# EAGLE design OpenScoreboard (EAGLE 6.5.0)
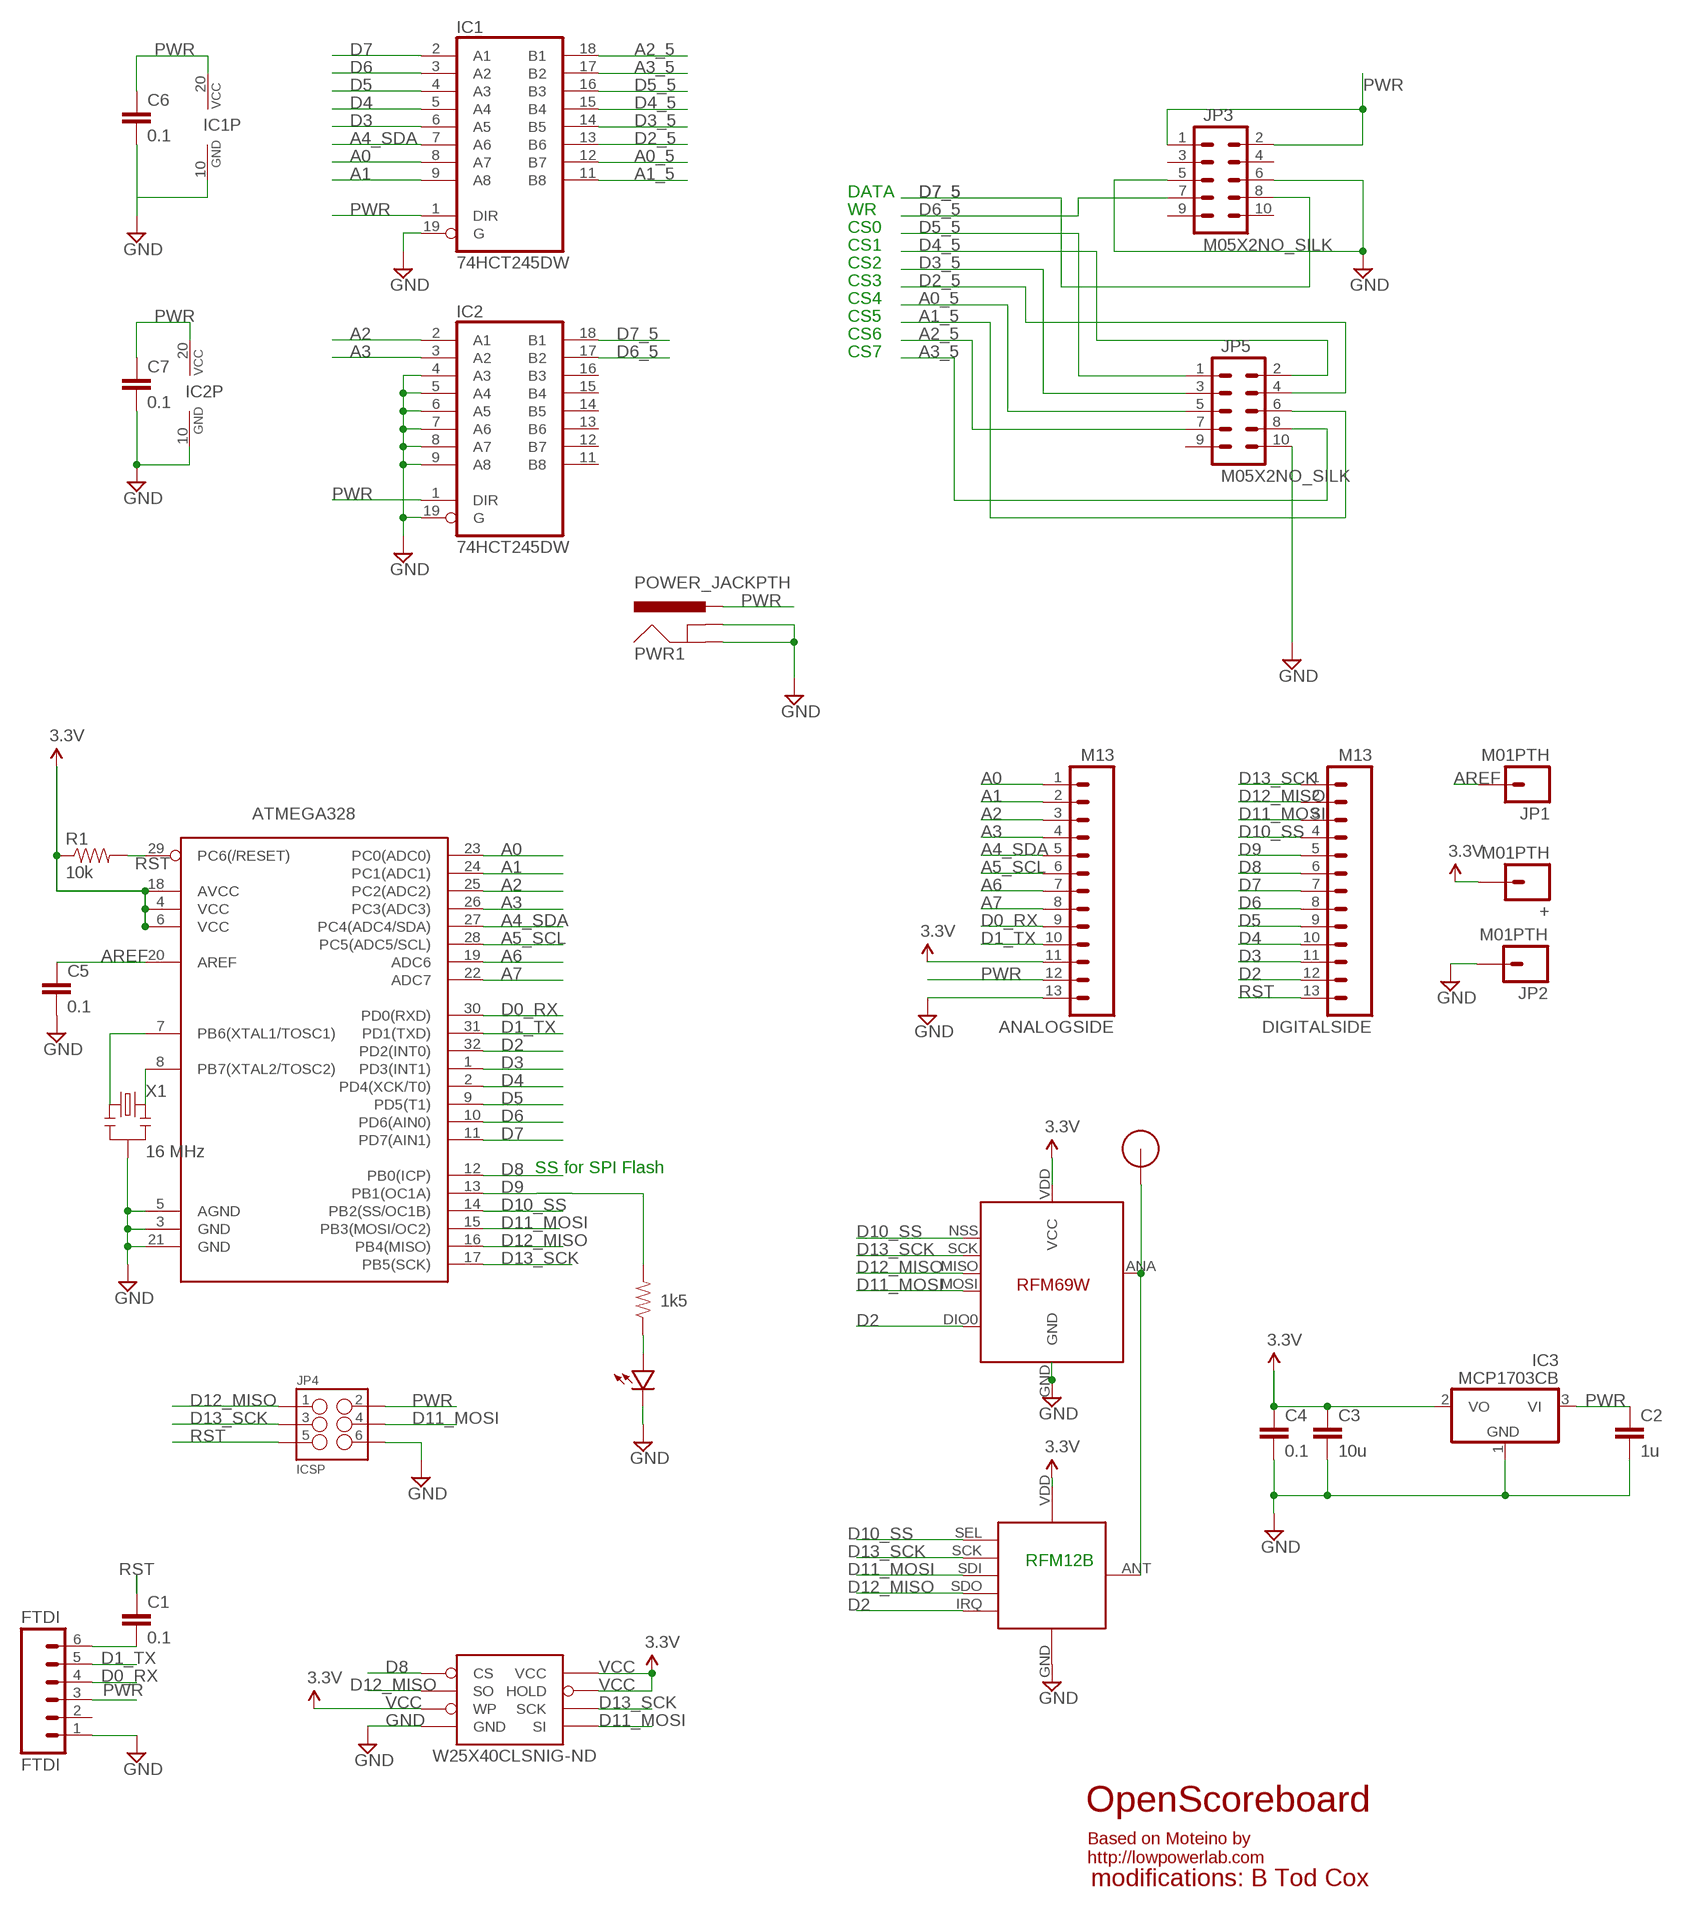
[diagram p0: schematic, sheet 1]

## Parts
+  M01PTH  [1X01]
ANALOGSIDE  M13  [1X13]
ATMEGA328  ATMega-328  ATMEGA168/328TQFP32  [TQFP32-08]
C1  0.1  CAP0603-CAP  [0603-CAP]
C2  1u  CAP0603-CAP  [0603-CAP]
C3  10u  CAP0805-CAP  [0805-CAP]
C4  0.1  CAP0603-CAP  [0603-CAP]
C5  0.1  CAP0603-CAP  [0603-CAP]
C6  0.1  CAP0603-CAP  [0603-CAP]
C7  0.1  CAP0603-CAP  [0603-CAP]
DIGITALSIDE  M13  [1X13]
FTDI  FTDI  M06SIP  [1X06]
IC1  74HCT245DW  [SO20W]
IC2  74HCT245DW  [SO20W]
IC3  MCP1703CB  [SOT23]
JP1  M01PTH  [1X01]
JP2  M01PTH  [1X01]
JP3  M05X2NO_SILK  [2X5_NOSILK]
JP4  ICSP  M03X2POGO_PINS  [2X3_POGO]
JP5  M05X2NO_SILK  [2X5_NOSILK]
PWR1  POWER_JACKPTH  [POWER_JACK_PTH]
R1  10k  RESISTOR0603-RES  [0603-RES]
R2  1k5  RESISTOR0603-RES  [0603-RES]
RFM12B  RFM12B_MINPADS  [RFM12B-MINPADS]
U$1  RFM12B_ANTENNA  [RFM12B-ANTENNA]
U$2  LED0603  [0603-LED]
U$5  RFM69  [RFM69W-MINPADS]
W25X40CLSNIG-ND  AT25F512BWIDE_5.3MM  [SO08WIDE]
X1  16 MHz  RESONATORSMD  [RESONATOR-SMD]

## Nets
A0: ANALOGSIDE.1 ATMEGA328.23(PC0(ADC0)) IC1.8(A7)
A0_5: IC1.12(B7) JP5.5
A1: ANALOGSIDE.2 ATMEGA328.24(PC1(ADC1)) IC1.9(A8)
A1_5: IC1.11(B8) JP5.6
A2: ANALOGSIDE.3 ATMEGA328.25(PC2(ADC2)) IC2.2(A1)
A2_5: IC1.18(B1) JP5.7
A3: ANALOGSIDE.4 ATMEGA328.26(PC3(ADC3)) IC2.3(A2)
A3_5: IC1.17(B2) JP5.8
A4_SDA: ANALOGSIDE.5 ATMEGA328.27(PC4(ADC4/SDA)) IC1.7(A6)
A5_SCL: ANALOGSIDE.6 ATMEGA328.28(PC5(ADC5/SCL))
A6: ANALOGSIDE.7 ATMEGA328.19(ADC6)
A7: ANALOGSIDE.8 ATMEGA328.22(ADC7)
AREF: ATMEGA328.20(AREF) C5.1 JP1.1
D0_RX: ANALOGSIDE.9 ATMEGA328.30(PD0(RXD)) FTDI.4
D1_TX: ANALOGSIDE.10 ATMEGA328.31(PD1(TXD)) FTDI.5
D2: ATMEGA328.32(PD2(INT0)) DIGITALSIDE.12 RFM12B.IRQ U$5.DIO0
D2_5: IC1.13(B6) JP5.4
D3: ATMEGA328.1(PD3(INT1)) DIGITALSIDE.11 IC1.6(A5)
D3_5: IC1.14(B5) JP5.3
D4: ATMEGA328.2(PD4(XCK/T0)) DIGITALSIDE.10 IC1.5(A4)
D4_5: IC1.15(B4) JP5.2
D5: ATMEGA328.9(PD5(T1)) DIGITALSIDE.9 IC1.4(A3)
D5_5: IC1.16(B3) JP5.1
D6: ATMEGA328.10(PD6(AIN0)) DIGITALSIDE.8 IC1.3(A2)
D6_5: IC2.17(B2) JP3.7
D7: ATMEGA328.11(PD7(AIN1)) DIGITALSIDE.7 IC1.2(A1)
D7_5: IC2.18(B1) JP3.8
D8: ATMEGA328.12(PB0(ICP)) DIGITALSIDE.6 W25X40CLSNIG-ND.1(CS)
D9: ATMEGA328.13(PB1(OC1A)) DIGITALSIDE.5 R2.2
D10_SS: ATMEGA328.14(PB2(SS/OC1B)) DIGITALSIDE.4 RFM12B.SEL U$5.NSS(SEL)
D11_MOSI: ATMEGA328.15(PB3(MOSI/OC2)) DIGITALSIDE.3 JP4.P$4 RFM12B.SDI(SDI/MOSI) U$5.MOSI W25X40CLSNIG-ND.5(SI)
D12_MISO: ATMEGA328.16(PB4(MISO)) DIGITALSIDE.2 JP4.P$1 RFM12B.SDO(SDO/MISO) U$5.MISO W25X40CLSNIG-ND.2(SO)
D13_SCK: ATMEGA328.17(PB5(SCK)) DIGITALSIDE.1 JP4.P$3 RFM12B.SCK U$5.SCK W25X40CLSNIG-ND.6(SCK)
GND [power]: ANALOGSIDE.13 ATMEGA328.3(GND) ATMEGA328.5(AGND) ATMEGA328.21(GND) C2.2 C3.2 C4.2 C5.2 C6.2 C7.2 FTDI.1 IC1.10(GND) IC1.19(G) IC2.4(A3) IC2.5(A4) IC2.6(A5) IC2.7(A6) IC2.8(A7) IC2.9(A8) IC2.10(GND) IC2.19(G) IC3.1(GND) JP2.1 JP3.5 JP3.6 JP4.P$6 JP5.10 PWR1.GND PWR1.GNDBREAK RFM12B.GND U$2.MINUS U$5.GND W25X40CLSNIG-ND.4(GND) X1.2
N$1: ATMEGA328.7(PB6(XTAL1/TOSC1)) X1.1
N$2: R2.1 U$2.PLUS
N$3: RFM12B.ANT U$1.P$1 U$5.ANA(ANT)
N$20: C1.2 FTDI.6
N$21: ATMEGA328.8(PB7(XTAL2/TOSC2)) X1.3
PWR [power]: ANALOGSIDE.12 C2.1 C6.1 C7.1 FTDI.3 IC1.1(DIR) IC1.20(VCC) IC2.1(DIR) IC2.20(VCC) IC3.3(VI) JP3.1 JP3.2 JP4.P$2 PWR1.PWR
RST: ATMEGA328.29(PC6(/RESET)) C1.1 DIGITALSIDE.13 JP4.P$5 R1.2
VCC: +.1 ANALOGSIDE.11 ATMEGA328.4(VCC) ATMEGA328.6(VCC) ATMEGA328.18(AVCC) C3.1 C4.1 IC3.2(VO) R1.1 RFM12B.VDD U$5.VDD(VCC) W25X40CLSNIG-ND.3(WP) W25X40CLSNIG-ND.7(HOLD) W25X40CLSNIG-ND.8(VCC) ; supply symbol labelled 3.3V
Unconnected: FTDI.2 IC2.11(B8) IC2.12(B7) IC2.13(B6) IC2.14(B5) IC2.15(B4) IC2.16(B3) JP3.3 JP3.4 JP3.9 JP3.10 JP5.9

## Notes on the sheet
- DATA
- WR
- CS0
- CS1
- CS2
- CS3
- CS4
- CS5
- CS6
- CS7
- SS for SPI Flash
- RFM12B
- OpenScoreboard
- Based on Moteino by
  http://lowpowerlab.com
- modifications: B Tod Cox

## Library data of the parts
+ JP1 JP2 = SparkFun-Connectors:M01: Header 1 Standard 1-pin 0.1" header. Use with straight break away headers (SKU : PRT-00116), right angle break away headers (PRT-00553), swiss pins (PRT-00743), machine pins (PRT-00117), and female headers (PRT-00115).
ANALOGSIDE DIGITALSIDE = SparkFun-Connectors:M13: 13-pin single row .1" header
ATMEGA328 = LowPowerLab:ATMEGA168/328: Atmel 32-pin 8-bit micro, 16k flash.
C1-C7 = LowPowerLab:CAP: Capacitor Standard 0603 ceramic capacitor, and 0.1" leaded capacitor.
FTDI = SparkFun-Connectors:M06: Header 6 Standard 6-pin 0.1" header. Use with straight break away headers (SKU : PRT-00116), right angle break away headers (PRT-00553), swiss pins (PRT-00743), machine pins (PRT-00117), and female headers (PRT-00115). Molex polarized connector foot print use with SKU : PRT-08094 with associated crimp pins and housings. NOTES ON THE VARIANTS LOCK and LOCK_LONGPADS... This footprint was designed to help hold the alignment of a through-hole component (i.e. 6-pin header) while soldering it into place. You may notice that each hole has been shifted either up or down by 0.005 of an inch from it's more standard position (which is a perfectly straight line). This slight alteration caused the pins (the squares in the middle) to touch the edges of the holes. Because they are alternating, it causes a "brace" to hold the component in place. 0.005 has proven to be the perfect amount of "off-center" position when using our standard breakaway headers. Although looks a little odd when you look at the bare footprint, once you have a header in there, the alteration is very hard to notice. Also, if you push a header all the way into place, it is covered up entirely on the bottom side. This idea of altering the position of holes to aid alignment will be further integrated into the Sparkfun Library for other footprints. It can help hold any component with 3 or more connection pins.
IC1 IC2 = 74xx-eu:74*245: Octal BUS TRANSCEIVER, 3-state
IC3 = linear:MCP1703: 250 mA, 16V, Low Quiescent Current LDO Regulator Source: http://ww1.microchip.com/downloads/en/DeviceDoc/22049b.pdf
JP3 JP5 = SparkFun-Connectors:M05X2: Header 5x2 Standard 10-pin dual row 0.1" header. Commonly used with AVR-ISP. Use with Spark Fun Electronics SKU: PRT-00778
JP4 = SparkFun-Connectors:M03X2: 2x3 .1" header. Shrouded, with keying- CONN-10681 SMT- CONN-11415 Pogo pins- HW-11044; PROD_ID: HW-11044
PWR1 = SparkFun-Connectors:POWER_JACK: Power Jack This is the standard 5.5mm barrel jack for power. The PTH is the most common, proven, reliable, footprint. The Slot footprint only works if the mill layer is transmitted to the PCB fab house so be warned. Spark Fun Electronics SKU : PRT-00119 SMT: CONN-08106 Mating wall wart : TOL-00298 (and others)
R1 R2 = LowPowerLab:RESISTOR: Resistor Basic schematic elements and footprints for 0603, 1206, and PTH resistors.
RFM12B = LowPowerLab:RFM12B_MINPADS
U$1 = LowPowerLab:RFM12B_ANTENNA
U$2 = LowPowerLab:LED
U$5 = LowPowerLab:RFM69
W25X40CLSNIG-ND = LowPowerLab:AT25F512B: 4-Mbit SPI flash memory
X1 = SparkFun:RESONATOR: Resonator Small SMD resonator. This is the itty bitty 10/20MHz resonators with built in caps. CSTCE10M0G55 and CSTCE20M0V53. Footprint has been reviewed closely but hasn't been tested yet.

## Net classes
0 default: width 0.203 mm, clearance 0.203 mm
1 power: width 0.381 mm, clearance 0.254 mm

## Board
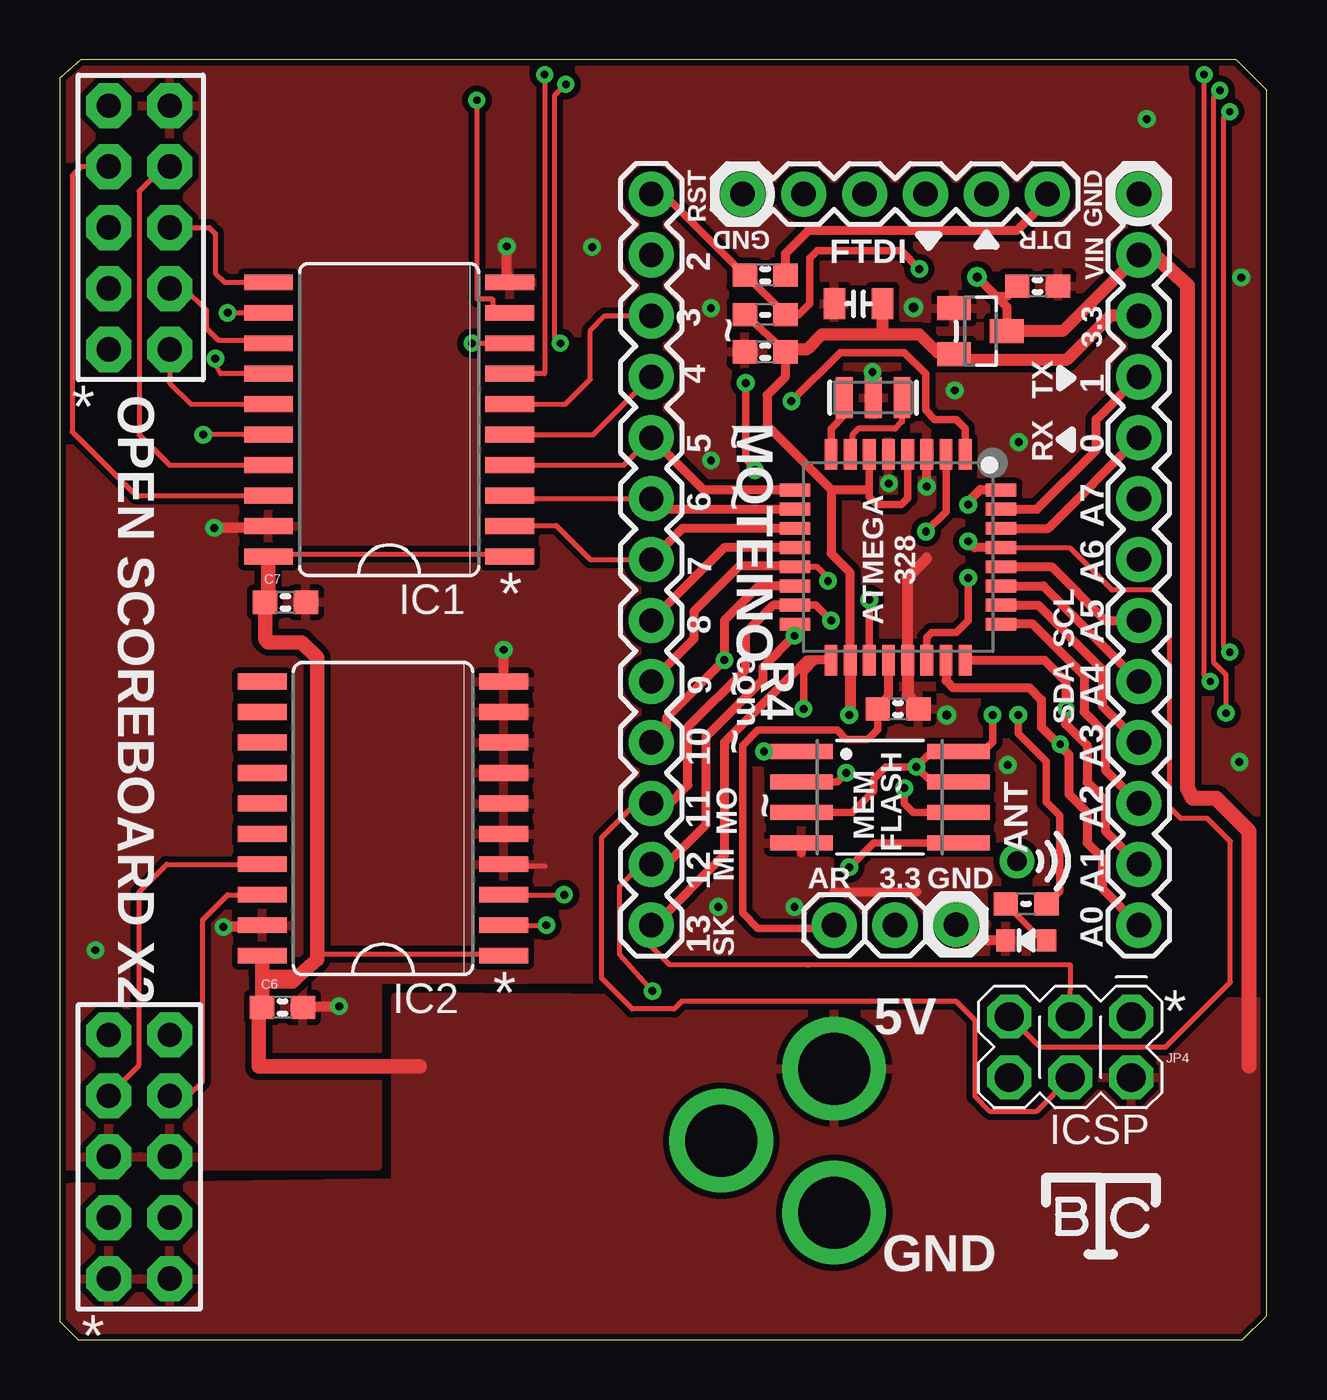
[diagram p1: board, top side]
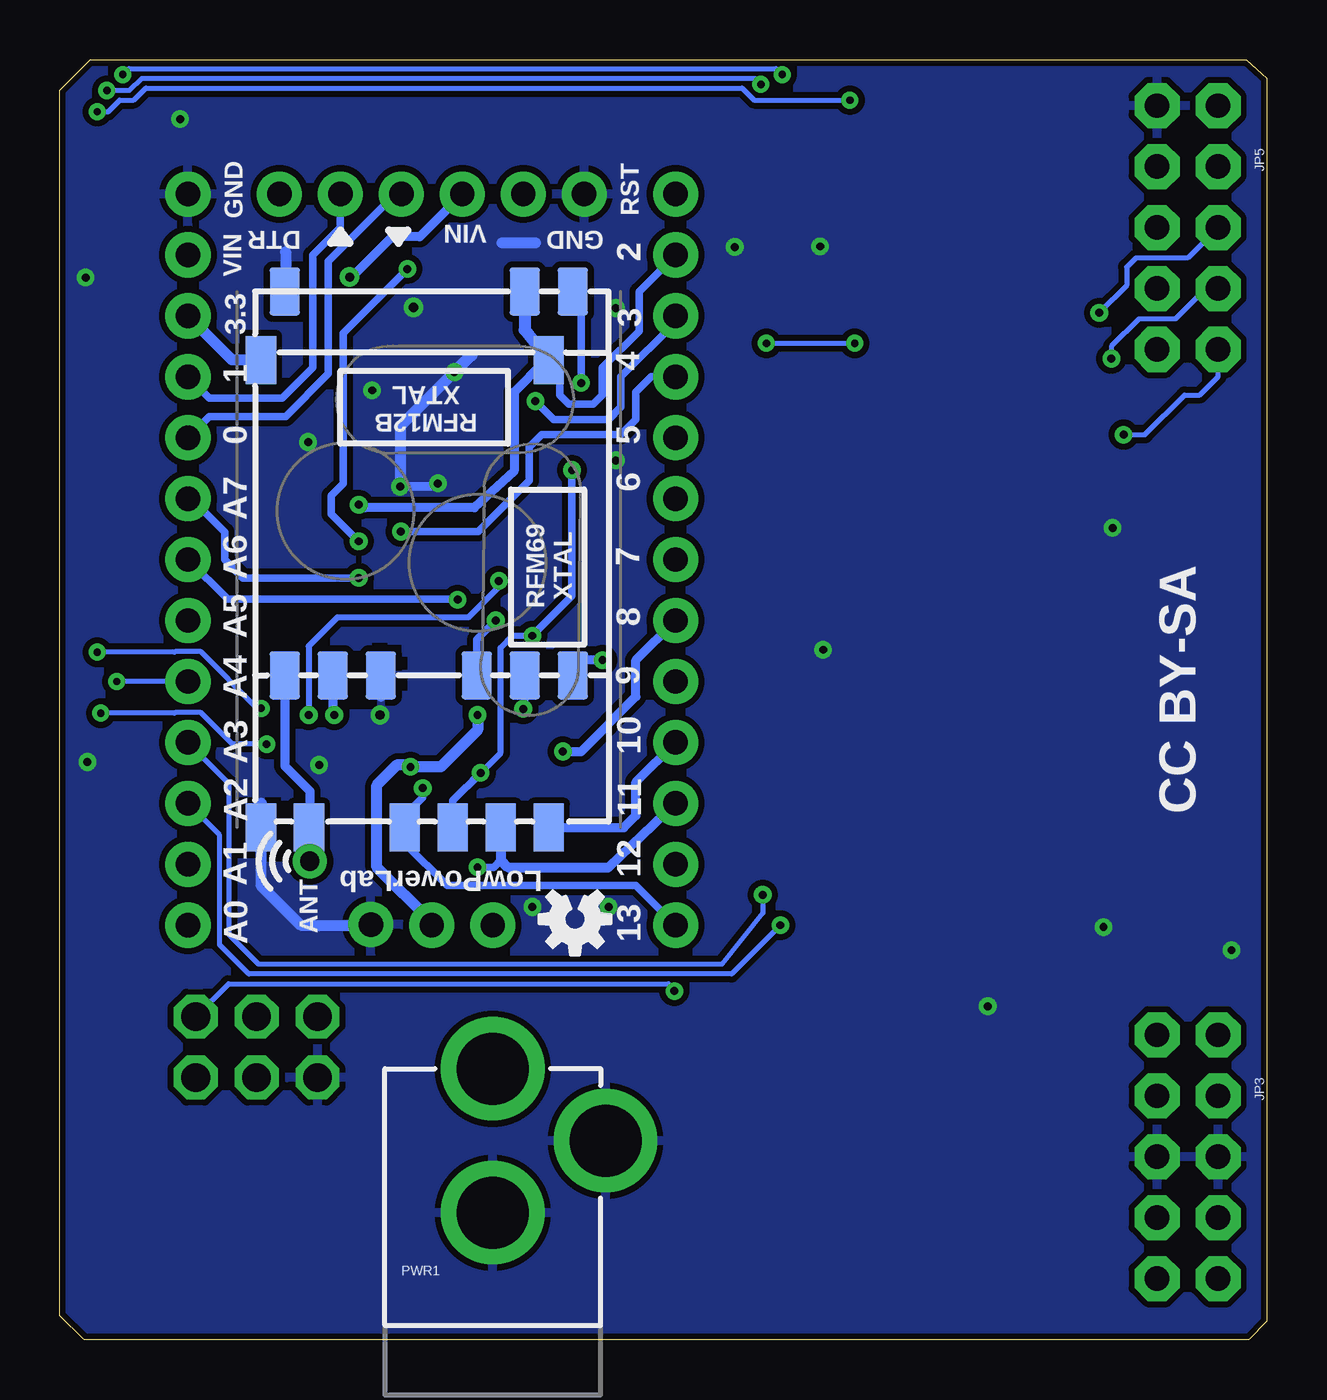
[diagram p2: board, bottom side, seen from below]

Size 50.29 x 53.34 mm. Coordinates in mm from the lower left corner, seen from the top.
Outline: 0,52.58 0,0.76 0.76,0 49.28,0 50.29,0.99 50.29,52.07 49.02,53.34 0.86,53.34 0,52.58
Copper layers (1*16): Top 0.035mm / dielectric 1.5mm / Bottom 0.035mm
Design rules "DFRobot_Eagle_Rule_v0.4": minimum track width 6mil, minimum drill 12mil, track to track 6mil, track to pad 6mil, pad to pad 6mil, via to via 6mil, smd to smd 0mil, copper to edge 10mil, drill to drill 10mil, minimum pad ring 12mil, minimum via ring 8mil, stop-mask expansion 2mil, vias tented up to drill 25mil, thermal gap 10mil
tRestrict: area 32.1,20.1 to 36.1,24.9; area 40.1,42.3 to 41.8,43.3; area 32.9,42.4 to 33.7,43.9
bRestrict: area 40.9,19.9 to 41.9,21.7; area 37.1,26.3 to 38.1,28.1; area 35.8,27.1 to 36.4,27.6; area 35.8,27.9 to 36.4,28.4; area 36.1,28.4 to 36.7,29; area 36.7,28.5 to 37.3,29; area 42.1,22.1 to 42.7,22.6; area 41.1,22.1 to 41.7,22.6; area 42.4,21.1 to 43,21.6; area 42.1,20.1 to 42.8,21.2

### Footprints (pad centres in the part's own frame; a part is rotated, then mirrored left to right if it is on the bottom)
1X01 = drill 1.016 pad 1.88: 1 0,0
1X13 = drill 1.016 pad 1.88: 1 0,0; 2 2.54,0; 3 5.08,0; 4 7.62,0; 5 10.16,0; 6 12.7,0; 7 15.24,0; 8 17.78,0; 9 20.32,0; 10 22.86,0; 11 25.4,0; 12 27.94,0; 13 30.48,0
TQFP32-08 = smd 1.27 x 0.533: 1 -4.293,2.8; 2 -4.293,2; 3 -4.293,1.2; 4 -4.293,0.4; 5 -4.293,-0.4; 6 -4.293,-1.2; 7 -4.293,-2; 8 -4.293,-2.8; 17 4.293,-2.8; 18 4.293,-2; 19 4.293,-1.2; 20 4.293,-0.4; 21 4.293,0.4; 22 4.293,1.2; 23 4.293,2; 24 4.293,2.8 | smd 0.533 x 1.27: 9 -2.8,-4.293; 10 -2,-4.293; 11 -1.2,-4.293; 12 -0.4,-4.293; 13 0.4,-4.293; 14 1.2,-4.293; 15 2,-4.293; 16 2.8,-4.293; 25 2.8,4.293; 26 2,4.293; 27 1.2,4.293; 28 0.4,4.293; 29 -0.4,4.293; 30 -1.2,4.293; 31 -2,4.293; 32 -2.8,4.293
0603-CAP = smd 1.016 x 0.965: 1 -0.85,0; 2 0.85,0
0805-CAP = smd 0.902 x 1.3: 1 -1,0; 2 1,0
1X06 = drill 1.016 pad 1.88: 1 0,0; 2 2.54,0; 3 5.08,0; 4 7.62,0; 5 10.16,0; 6 12.7,0
SO20W = smd 0.66 x 2.032: 1 -5.715,-5.029; 2 -4.445,-5.029; 3 -3.175,-5.029; 4 -1.905,-5.029; 5 -0.635,-5.029; 6 0.635,-5.029; 7 1.905,-5.029; 8 3.175,-5.029; 9 4.445,-5.029; 10 5.715,-5.029; 11 5.715,5.029; 12 4.445,5.029; 13 3.175,5.029; 14 1.905,5.029; 15 0.635,5.029; 16 -0.635,5.029; 17 -1.905,5.029; 18 -3.175,5.029; 19 -4.445,5.029; 20 -5.715,5.029
SOT23 = smd 1 x 1.4: 1 -0.95,-1.1; 2 0.95,-1.1; 3 0,1.1
2X5_NOSILK = drill 1.016 pad 1.88 octagon: 1 -1.27,5.08; 2 1.27,5.08; 3 -1.27,2.54; 4 1.27,2.54; 5 -1.27,0; 6 1.27,0; 7 -1.27,-2.54; 8 1.27,-2.54; 9 -1.27,-5.08; 10 1.27,-5.08
2X3_POGO = drill 1.2 pad 1.829 octagon: P$1 0,0; P$2 0,2.54; P$3 2.54,0; P$4 2.54,2.54; P$5 5.08,0; P$6 5.08,2.54
POWER_JACK_PTH = drill 2.997 pad 4.318: GND 0,7.7; GNDBREAK 4.7,10.7; PWR 0,13.7
0603-RES = smd 1.016 x 0.965: 1 -0.85,0; 2 0.85,0
RFM12B-MINPADS = smd 2 x 1.27: ANT 8,-6; GND 8,-2; IRQ -8,4; SCK 8,4; SDI 8,2; SDI1 -8.002,-6.001; SDO -8,6; SEL 8,6; VDD 8,-4
RFM12B-ANTENNA = drill 0.8 pad 1.422: P$1 0,0
0603-LED = smd 0.8 x 0.9: MINUS -0.85,0; PLUS 0.85,0
RFM69W-MINPADS = smd 2 x 1.27: ANA 8,-5; DIO0 -11.5,5; GND 8,-7; MISO 8,1; MOSI 8,3; NSS 8,5; SCK 8,-1; VDD -11.5,-7
SO08WIDE = smd 0.61 x 2.6: 1 -1.905,-3.269; 2 -0.635,-3.269; 3 0.635,-3.269; 4 1.905,-3.269; 5 1.905,3.286; 6 0.635,3.286; 7 -0.635,3.286; 8 -1.905,3.286
RESONATOR-SMD = smd 0.7 x 1.7: 1 -1.2,0; 2 0,0; 3 1.2,0

### Placement (x,y rotation side)
+  34.8,17.27 180 top
ANALOGSIDE  44.96,17.27 90 top
ATMEGA328  34.92,32.61 270 top
C1  29.39,44.37 0 top
C2  40.74,43.92 0 top
C3  33.27,43.18 180 top
C4  29.39,41.17 180 top
C5  34.92,26.29 0 top
C6  9.27,13.84 0 top
C7  9.4,30.73 0 top
DIGITALSIDE  24.64,17.27 90 top
FTDI  28.45,47.75 0 top
IC1  13.72,38.35 90 top
IC2  13.46,21.72 90 top
IC3  38.35,42.04 270 top
JP1  32.26,17.27 270 top
JP2  37.34,17.3 270 top
JP3  3.3,7.62 180 bottom
JP4  44.64,13.46 180 top
JP5  3.3,46.35 180 bottom
PWR1  32.26,-2.41 0 bottom
R1  29.39,42.72 0 top
R2  40.26,18.16 0 top
RFM12B  34.92,35.69 270 bottom
U$1  39.88,19.94 270 top
U$2  40.26,16.64 0 top
U$3  [OSHW-LOGO-S]  28.83,17.53 180 bottom
U$5  34.92,29.34 270 bottom
W25X40CLSNIG-ND  34.16,22.61 270 top
X1  33.88,39.27 180 top

### Tracks (layer width: path | path; a pad name or v marks a point on that pad's centre or on a via)
A0  (via drill 0.3)
  Top 0.203: v17.17,41.53 IC1.8 | v20.85,41.53 20.6,41.78 20.6,51.84 v21.08,52.32 | v48.34,52.07 48.08,51.82 48.08,28.22 48.59,27.71 v48.59,26.11 | v41.68,24.82 41.64,24.78
  Top 0.381: ATMEGA328.23 36.92,27.46 37.21,27.18 40.39,27.18 40.89,26.67 40.89,25.53 41.64,24.78 42.04,24.38 42.04,22.73 42.8,21.97 42.8,20.7 43.43,20.07 43.43,18.8 ANALOGSIDE.1
  Bottom 0.203: v20.85,41.53 v17.17,41.53 | v21.08,52.32 21.34,52.58 46.89,52.58 47.4,52.07 v48.34,52.07 | v48.59,26.11 45.52,26.11 45.49,26.14 44.42,26.14 43.1,24.82 v41.68,24.82
A0_5  (via drill 0.33 pad 0.74)
  Top 0.203: v6.98,42.8 IC1.12
  Bottom 0.203: JP5.5 3.3,45.09 5.46,45.09 5.84,44.7 5.84,43.94 v6.98,42.8
A1  (via drill 0.3)
  Top 0.203: IC1.9 18.03,42.8 18.03,43.36 18.01,43.38 17.37,43.38 v17.37,51.66 | v48.74,51.18 48.49,50.93 48.49,28.91 v48.74,28.65
  Top 0.381: ATMEGA328.24 41.02,28.32 41.91,27.43 v41.91,26.31 41.91,25.65 42.8,24.77 42.8,23.24 43.56,22.48 43.56,21.21 ANALOGSIDE.2
  Bottom 0.203: v17.37,51.66 21.36,51.66 21.87,52.17 46.71,52.17 47.22,51.66 47.8,51.66 48.29,51.18 v48.74,51.18 | v48.74,28.65 45.52,28.65 45.49,28.68 44.42,28.68 42.06,26.31 v41.91,26.31
A1_5
  Top 0.203: JP5.6 6.22,46.35 6.48,46.1 6.48,44.45 6.86,44.07 IC1.11
A2  (via drill 0.33 pad 0.74)
  Top 0.203: IC2.2 v20.27,17.27
  Top 0.381: ATMEGA328.25 39.22,29.84 40.51,29.84 42.67,27.69 42.67,26.16 43.56,25.27 43.56,23.75 ANALOGSIDE.3
  Bottom 0.203: v20.27,17.27 22.3,15.24 42.42,15.24 43.64,16.46 43.64,21.03 ANALOGSIDE.3
A2_5
  Top 0.203: JP5.7 0.89,48.9 0.51,48.51 0.51,37.85 3.18,35.18 IC1.18
A3  (via drill 0.33 pad 0.74)
  Top 0.203: IC2.3 v21.01,18.54
  Top 0.381: ATMEGA328.26 40.76,30.61 43.43,27.94 43.43,26.42 ANALOGSIDE.4
  Bottom 0.203: v21.01,18.54 21.01,17.78 22.71,15.65 42.01,15.65 43.23,16.87 43.23,23.16 ANALOGSIDE.4
A3_5
  Top 0.203: JP5.8 4.32,48.9 3.3,47.88 3.3,37.72 4.57,36.45 IC1.17
A4_SDA  (via drill 0.3)
  Top 0.203: IC1.7 20.19,40.26 v20.19,52.73 | v47.68,52.73 47.68,27.69 v47.93,27.43
  Top 0.381: ATMEGA328.27 40.98,31.41 ANALOGSIDE.5
  Bottom 0.203: v20.19,52.73 20.45,52.98 47.42,52.98 v47.68,52.73 | ANALOGSIDE.5 v47.93,27.43
A5_SCL
  Top 0.381: ATMEGA328.28 41.32,32.21 43.56,29.97 ANALOGSIDE.6
A6  (via drill 0.33)
  Top 0.305: ATMEGA328.19 v33.73,30.84
  Bottom 0.305: 33.66,30.86 43.31,30.86 ANALOGSIDE.7
  Bottom 0.381: 33.66,30.86 v33.73,30.84
A7  (via drill 0.33)
  Top 0.305: ATMEGA328.22 36.12,29.27 36.32,29.46 37.34,29.46 37.85,29.97 v37.85,31.75
  Bottom 0.305: v37.85,31.75 42.67,31.75 43.43,32.51 43.43,33.66 44.83,35.05 ANALOGSIDE.8
AREF
  Top 0.305: C5.1 34.08,25.44 33.66,25.02 32.77,25.02 32.38,25.4 29.08,25.4 28.45,24.77 28.45,17.78 29.08,17.14 32.13,17.14 JP1.1
  Top 0.381: ATMEGA328.20 34.52,26.87 C5.1
D0_RX
  Top 0.381: ATMEGA328.30 41.18,33.81 ANALOGSIDE.9
  Bottom 0.305: ANALOGSIDE.9 44.07,38.48 40.89,38.48 39.12,40.26 39.12,44.96 36.32,47.75 FTDI.4
D1_TX
  Top 0.381: ATMEGA328.31 40.71,34.61 43.18,37.08 43.18,38.35 ANALOGSIDE.10
  Bottom 0.305: FTDI.5 38.61,46.35 39.75,45.21 39.75,40.51 41.02,39.24 44.07,39.24 ANALOGSIDE.10
D2  (via drill 0.33)
  Top 0.381: v37.85,34.8 37.85,34.92 38.35,35.43 39.07,35.43 ATMEGA328.32
  Bottom 0.305: DIGITALSIDE.12 26.16,43.69 26.16,42.04 27.69,40.51 27.69,39.37 28.07,38.99 29.08,38.99 29.46,39.37 29.46,40.38 U$5.DIO0
  Bottom 0.381: 30.13,41.3 30.13,40.74 31.37,39.5 31.37,36.2 33.02,34.67 37.59,34.67 v37.85,34.8
  Bottom 0.406: U$5.DIO0 29.92,41.09 30.13,41.3
  Bottom 0.508: RFM12B.IRQ 30.92,42.09 U$5.DIO0
D2_5
  Top 0.203: JP5.4 5.21,43.81 6.1,42.93 6.1,42.16 6.6,41.66 8.56,41.66 IC1.13
D3  (via drill 0.33)
  Top 0.203: IC1.6 21.06,38.99 22.1,40.03 22.1,42.06 22.71,42.67 DIGITALSIDE.11
  Top 0.305: v30.48,39.12 32.51,41.15 35.18,41.15 36.07,40.26 36.07,38.73 36.45,38.35 37.34,38.35 37.72,37.97 ATMEGA328.1
  Top 0.381: ATMEGA328.1
  Bottom 0.305: DIGITALSIDE.11 24.64,42.42 26.92,40.13 26.92,38.86 27.43,38.35 29.72,38.35 v30.48,39.12
D3_5  (via drill 0.33 pad 0.74)
  Top 0.203: IC1.14 6.68,40.26 6.48,40.64 v6.48,40.89
  Bottom 0.203: JP5.3 2.54,43.81 3.81,42.54 5.33,42.54 6.48,41.4 v6.48,40.89
D4  (via drill 0.33)
  Top 0.203: IC1.5 22.23,37.72 DIGITALSIDE.10
  Top 0.305: ATMEGA328.2 36.92,34.52 v36.09,33.68
  Top 0.381: 36.98,36.98 ATMEGA328.2
  Bottom 0.305: DIGITALSIDE.10 25.65,40.13 26.29,39.5 26.29,38.35 26.92,37.72 30.23,37.72 30.73,37.21 30.73,35.81 32.86,33.68 v36.09,33.68
D4_5
  Top 0.203: JP5.2 4.57,39.88 5.46,38.99 IC1.15
D5
  Top 0.203: IC1.4 23.49,36.45 DIGITALSIDE.9
  Top 0.381: ATMEGA328.9 26.82,35.41 DIGITALSIDE.9
D5_5  (via drill 0.33 pad 0.74)
  Top 0.203: IC1.16 v5.97,37.72
  Bottom 0.203: v5.97,37.72 5.08,37.72 3.43,39.37 2.79,39.37 2.03,40.13 JP5.1
D6
  Top 0.203: IC1.3 18.87,35.05 DIGITALSIDE.8
  Top 0.381: DIGITALSIDE.8 25.08,34.61 ATMEGA328.10
D6_5
  Top 0.203: JP3.7 3.3,11.43 3.3,18.67 4.45,19.81 IC2.17
D7
  Top 0.203: IC1.2 18.77,33.93 20.68,33.93 22.1,32.51 DIGITALSIDE.7
  Top 0.381: ATMEGA328.11 25.94,33.81 DIGITALSIDE.7
D7_5
  Top 0.203: JP3.8 5.33,10.16 5.94,10.77 5.94,17.5 6.98,18.54 IC2.18
D8  (via drill 0.33)
  Top 0.305: v29.34,24.51 30.99,24.52 W25X40CLSNIG-ND.1
  Top 0.381: ATMEGA328.12 27.68,33.01 DIGITALSIDE.6
  Bottom 0.381: v29.34,24.51 28.58,24.51 26.29,26.8 26.29,28.32 DIGITALSIDE.6
D9  (via drill 0.33)
  Top 0.254: ATMEGA328.13 31.54,32.21 32,31.75 v32,31.62
  Top 0.305: R2.2 41.36,18.38 41.66,18.67 41.66,21.84 41.1,22.4 41.1,24.1 39.93,25.27 v39.93,26.03
  Top 0.381: ATMEGA328.13 30.55,32.26 28.32,32.26 26.42,30.35 26.42,29.21 DIGITALSIDE.5
  Bottom 0.254: v32,31.62 32,31.37 33.27,30.1 38.73,30.1 39.93,28.91 v39.93,26.03
D10_SS  (via drill 0.33)
  Top 0.381: ATMEGA328.14 29.13,31.41 27.69,29.97 v27.69,28.32 25.27,25.91 25.27,25.53 DIGITALSIDE.4
  Bottom 0.254: 28.67,28.32 RFM12B.SEL
  Bottom 0.381: v27.69,28.32 28.67,28.32 | U$5.NSS 26.8,21.34 26.29,21.84 26.29,23.24 DIGITALSIDE.4
D11_MOSI  (via drill 0.33)
  Top 0.203: DIGITALSIDE.3 24,22.35 22.57,20.92 22.57,15.05 23.84,13.78 25.59,13.78 25.91,14.1 37.34,14.1 38.13,13.3 38.13,10.13 38.77,9.49 40.67,9.49 JP4.P$4
  Top 0.305: v32.89,19.68 33.91,20.7 W25X40CLSNIG-ND.5 | ATMEGA328.15 31.49,30.61 v32.13,29.97
  Top 0.381: ATMEGA328.15 29.73,30.61 28.58,29.46 28.58,27.94 26.16,25.53 26.16,23.11 25.4,22.35 DIGITALSIDE.3
  Bottom 0.305: v32.89,19.68 32.23,19.68 31.92,19.99 | v32.13,29.97 32.92,29.18 RFM12B.SDI
  Bottom 0.381: DIGITALSIDE.3 27.43,19.68
  Bottom 0.406: U$5.MOSI 31.92,19.99 31.62,19.68 27.43,19.68
D12_MISO  (via drill 0.33, 0.33 pad 0.74)
  Top 0.203: 24.48,19.81 DIGITALSIDE.2 24.23,19.81 23.32,18.9 23.32,16.05 v24.69,14.53
  Top 0.305: v32.77,23.62 32.38,23.24 W25X40CLSNIG-ND.2 | v28.58,39.88 28.58,36.75 v28.96,36.25
  Top 0.381: ATMEGA328.16 30.63,29.23 v30.61,29.34 29.3,28.03 29.3,27.52 26.92,25.15 26.92,21.46 25.27,19.81 DIGITALSIDE.2
  Bottom 0.203: JP4.P$1 43.27,14.83 24.94,14.83 v24.69,14.53
  Bottom 0.254: v32.77,23.62 31.93,24.46 31.93,28.83 31.42,29.34 v30.61,29.34
  Bottom 0.305: U$5.MISO 33.92,22.46 v32.77,23.62 33.08,23.3 | v30.61,29.34 28.96,30.99 v28.96,36.25 | v28.58,39.88 28.58,43.34 RFM12B.SDO
D13_SCK  (via drill 0.33)
  Top 0.203: JP4.P$3 42.11,15.61 31.17,15.61 31.08,15.62 25.4,15.62 24.64,16.38 DIGITALSIDE.1
  Top 0.305: v35.18,22.99 35.18,22.35 35.56,21.97 W25X40CLSNIG-ND.6 | v30.99,26.29 30.99,27.81 31.5,28.32
  Top 0.381: DIGITALSIDE.1 24.77,17.27 27.69,20.19 27.69,24.9 31.11,28.32 31.5,28.32 ATMEGA328.17
  Bottom 0.305: RFM12B.SCK 30.92,26.35 v30.99,26.29 | DIGITALSIDE.1 26.29,18.92 34.16,18.92 35.92,20.68 U$5.SCK 35.94,21.35 35.94,21.84 35.18,22.61 v35.18,22.99
GND  (via drill 0.33, 0.33 pad 0.74, 0.38, 0.41)
  Top 0.203: IC2.4 18.57,19.74 20.22,19.74
  Top 0.381: 35.31,28.21 ATMEGA328.21 | v36.12,35.56 ATMEGA328.3 | 36.12,32.62 36.12,32.56 | W25X40CLSNIG-ND.4 30.89,20.29 | 32.26,18.67 35.71,18.67 | v33.86,40.33 X1.2
  Top 0.406: U$2.MINUS 38,16.64 JP2.1 | IC2.19 8.36,17.2 v6.81,17.2 | IC1.19 8.61,33.83 v6.43,33.83 | C6.2 10.17,13.89 v11.63,13.89 | IC2.10 v18.49,28.75 | IC1.10 18.62,44.2 v18.62,45.57
  Top 0.457: 35.31,28.21 35.31,31.75 36.12,32.56
  Top 0.508: ATMEGA328.21 35.33,26.87 C5.2 35.65,26.16
  Bottom 0.381: 36.05,35.56 v36.12,35.56 34.54,35.56 v34.54,35.69 | RFM12B.GND 36.92,26.77
  Bottom 0.457: 41.92,22.34 41.92,18.94 40.26,17.27 37.36,17.27 JP2.1 | v33.86,40.33 36.12,38.07 v36.12,35.56 | 31.88,45.72 30.48,45.72 | 40.89,45.34 40.89,43.84
  Bottom 0.508: U$5.GND 41.92,22.34 | 33.15,41.03 v33.86,40.33
  other vias: 35.57,43.03 36.96,26.03 27.13,43 27.13,36.65 37.29,39.57 39.95,37.41 39.5,23.95 30.61,18.03 27.43,18.03 1.47,16.23 49.15,24.08 49.23,44.27 45.29,50.88 22.17,45.54
  pour Bottom: 50.42,53.59 -0.76,53.47 -0.13,-0.25 50.42,-0.13
  pour Top: 51.05,54.23 -1.4,54.1 -1.02,7.24 13.23,7.24 13.23,14.99 50.42,15.11
N$1
  Top 0.254: X1.1 35.08,38.26 34.8,37.97 33.27,37.97 33.02,37.72 33.02,37 ATMEGA328.7
N$2
  Top 0.254: R2.1 40.81,16.76 U$2.PLUS
N$3
  Bottom 0.381: U$1.P$1 39.92,20.65 U$5.ANA 39.88,21.64 39.88,22.86 40.92,23.91 RFM12B.ANT
N$20
  Top 0.381: C1.2 30.24,45.29 31.18,46.23 39.88,46.23 41.15,47.5 FTDI.6
N$21
  Top 0.305: X1.3 32.68,38.53 32.13,37.97 ATMEGA328.8
PWR  (via drill 0.38 pad 0.81)
  Top 0.203: IC2.1 18.44,16.05 10.72,16.05 | IC1.1 18.67,32.71 9.3,32.71 9.22,32.64 IC1.20
  Top 0.381: v38.22,44.29 39.03,43.48 | 39.03,43.48 39.45,43.05 IC3.3 | C2.1 39.45,43.48 39.03,43.48 | 9.83,15.05 9.65,15.24 8.42,15.24 8.38,15.24
  Top 0.508: ANALOGSIDE.12 41.78,42.04 IC3.3
  Top 0.61: IC2.20 8.42,16 8.42,15.24 C6.1 8.25,13.84 8.28,13.82 8.28,11.38 14.99,11.38 | 8.69,14.94 9.7,14.94 9.83,15.05 10.72,15.85 10.72,16.05 10.72,28.42 10.08,29.06 8.69,29.06 8.55,29.2 C7.1 8.69,30.87 IC1.20
  Top 0.635: 49.55,11.39 49.55,21.18 48.18,22.55 47.19,22.55 46.99,22.99 46.99,43.94 45.59,45.21 ANALOGSIDE.12
  Bottom 0.381: FTDI.3 35.31,45.97 36.45,45.97 38.26,44.16 v38.22,44.29
  pour Top: -1.02,6.35 14,6.55 14,14.3 50.67,14.1 50.67,-0.51 -1.14,-0.63
RST  (via drill 0.33, 0.33 pad 0.69)
  Top 0.203: JP4.P$5 40.83,12.19 46.07,12.19 48.77,14.89 48.77,20.77 47.82,21.72 46.7,21.72 46.23,22.19 46.23,30.61 45.59,31.24 43.85,31.24 42.1,32.99 39.24,32.99 ATMEGA328.29
  Top 0.305: DIGITALSIDE.13 25.16,47.75 C1.1 28.59,44.37 R1.2 30.79,42.72 31.24,43.18 31.24,45.09 31.55,45.39 35.05,45.39 v35.81,44.63
  Top 0.381: ATMEGA328.29 38.11,33.01 v37.85,33.27
  Bottom 0.305: v37.85,33.27 38.99,34.42 38.99,35.18 38.48,35.69 38.48,41.96 v35.81,44.63
VCC  (via drill 0.33)
  Top 0.305: ATMEGA328.4 35.33,35.07 35.05,34.8 34.04,34.8 33.73,35.12 33.73,35.31 | ATMEGA328.6 33.73,35.31 | v35.69,23.88 36.32,24.51 W25X40CLSNIG-ND.8 | v35.69,23.88 36.32,23.24 W25X40CLSNIG-ND.7 | v35.69,23.88 34.42,23.88 33.91,23.37 33.91,22.86 33.02,21.97 W25X40CLSNIG-ND.3 | v38.86,26.03 38.86,24.91 38.47,24.51 | 33.6,35.43 33.73,35.31 | R1.1 28.56,42.72 C4.1
  Top 0.381: 38.47,24.51 W25X40CLSNIG-ND.8 | ATMEGA328.18 32.92,31.97 32.13,32.77 32.13,35.43 | 32.13,35.43 33.6,35.43 | C4.1 30.21,40.12 29.46,39.37 29.46,38.1 32.13,35.43
  Top 0.457: ATMEGA328.18 32.92,25.94 v32.89,26.03
  Top 0.508: C4.1 30.31,41.27 31.12,41.27 31.75,41.91 34.29,41.91 | 34.29,41.91 35.81,41.91 36.58,41.15 37.19,41.15 IC3.2 | C3.1 34.27,41.93 34.29,41.91 | IC3.2 37.08,40.92 | ANALOGSIDE.11 43.76,42.67 U$5.VDD 37.5,40.84 IC3.2
  Top 0.635: 36.98,40.92 37.08,40.92
  Bottom 0.381: RFM12B.VDD 38.92,25.97 v38.86,26.03
  Bottom 0.457: +.1 34.8,17.4 37.08,19.68 37.08,23.11 36.23,23.96 35.78,23.96 v35.69,23.88 34.42,23.88 32.89,25.4 v32.89,26.03 | U$5.VDD 43.12,40.84 ANALOGSIDE.11

### Text on the board
tPlace: OPEN SCOREBOARD X2 | * | MOTEINO | .com | R4 | 5V | * | GND | *
bPlace: RFM12B / XTAL | RFM69 / XTAL | CC BY-SA | LowPowerLab
tDocu: REG
_tsilk: RST | GND | GND | DTR | 2 | FTDI | VIN | ~ | 3 | 3.3 | 4 | 1 | TX | ~ | 5 | RX | 0 | ~ | 6 | A7 | ATMEGA / 328 | 7 | SCL | A6 | * | 8 | SDA | A5 | ~ | 9 | A4 | ~ | FLASH | 10 | MEM | ANT | A3 | MO | ~ | 11 | A2 | MI | AR | 3.3 | GND | 12 | A1 | SK | A0 | 13 | *
_bsilk: RST | VIN | GND | 2 | GND | DTR | VIN | 3.3 | 3 | 4 | 1 | 5 | 0 | 6 | A7 | A6 | 7 | 8 | A5 | A4 | 9 | 10 | A3 | 11 | A2 | 12 | A1 | ANT | A0 | 13